# Altium schematic sheet INC_ENC_IF.SchDoc
size 420 x 297 mm; SheetNumber: 5; PageSetup: Record=PageOptions|CenterHorizontal=False|CenterVertical=False|PrintScale=0.95|XCorrection=0.00|YCorrection=0.00|PrintKind=1|BorderSize=5000000|LeftOffset=0|BottomOffset=0|Orientation=1|PaperLength=1000|PaperWidth=1000|Scale=100|PaperSource=15|PrintQuality=600|MediaType=1|DitherType=10|PaperKind=A4|PrintScaleMode=1
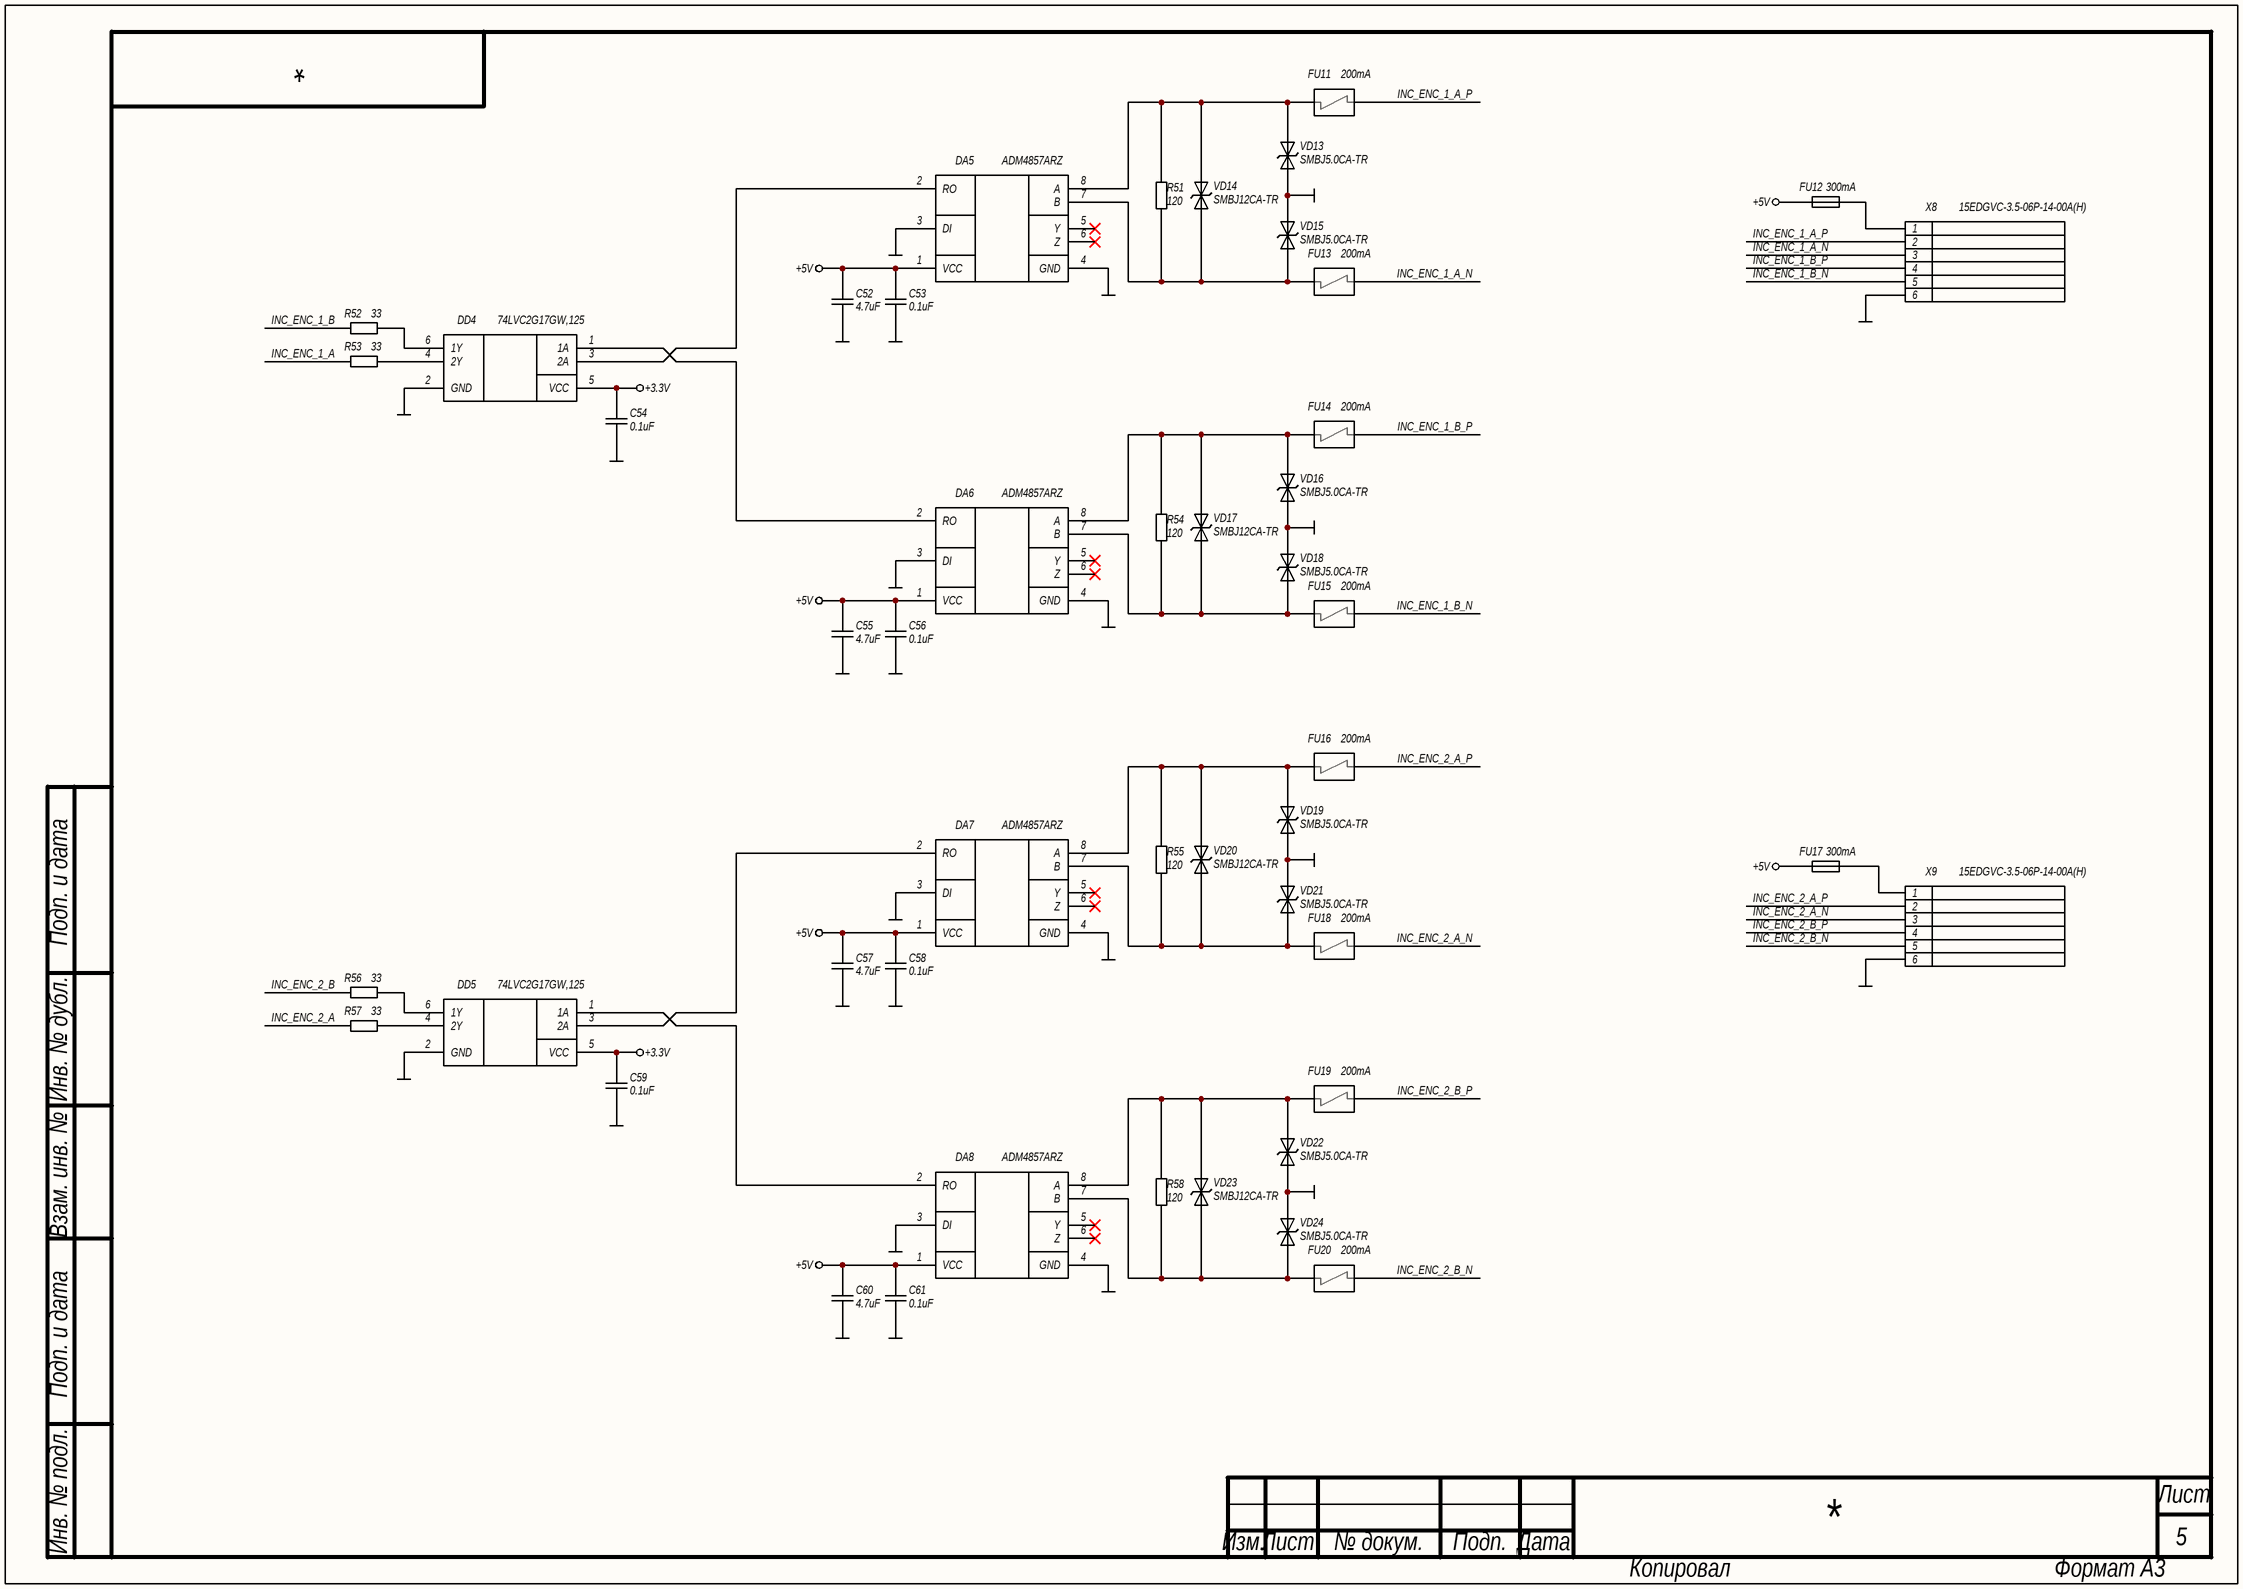
[diagram p0: INC_ENC_IF.SchDoc]

## Parts
C52  4.7uF  [C0603N]
C53  0.1uF  [C0603N]
C54  0.1uF  [C0603N]
C55  4.7uF  [C0603N]
C56  0.1uF  [C0603N]
C57  4.7uF  [C0603N]
C58  0.1uF  [C0603N]
C59  0.1uF  [C0603N]
C60  4.7uF  [C0603N]
C61  0.1uF  [C0603N]
DA5  ADM4857ARZ  [SOIC8]
DA6  ADM4857ARZ  [SOIC8]
DA7  ADM4857ARZ  [SOIC8]
DA8  ADM4857ARZ  [SOIC8]
DD4  74LVC2G17GW,125  [SOT363-2]
DD5  74LVC2G17GW,125  [SOT363-2]
FU11  200mA  [TBU-CA]
FU12  300mA  [MF-MSMF]
FU13  200mA  [TBU-CA]
FU14  200mA  [TBU-CA]
FU15  200mA  [TBU-CA]
FU16  200mA  [TBU-CA]
FU17  300mA  [MF-MSMF]
FU18  200mA  [TBU-CA]
FU19  200mA  [TBU-CA]
FU20  200mA  [TBU-CA]
R51  120  [R0805N]
R52  33  [R0603N]
R53  33  [R0603N]
R54  120  [R0805N]
R55  120  [R0805N]
R56  33  [R0603N]
R57  33  [R0603N]
R58  120  [R0805N]
VD13  SMBJ5.0CA-TR  [SMB]
VD14  SMBJ12CA-TR  [SMB]
VD15  SMBJ5.0CA-TR  [SMB]
VD16  SMBJ5.0CA-TR  [SMB]
VD17  SMBJ12CA-TR  [SMB]
VD18  SMBJ5.0CA-TR  [SMB]
VD19  SMBJ5.0CA-TR  [SMB]
VD20  SMBJ12CA-TR  [SMB]
VD21  SMBJ5.0CA-TR  [SMB]
VD22  SMBJ5.0CA-TR  [SMB]
VD23  SMBJ12CA-TR  [SMB]
VD24  SMBJ5.0CA-TR  [SMB]
X8  15EDGVC-3.5-06P-14-00A(H)  [15EDGVC-3.5-06P-14-00A(H)]
X9  15EDGVC-3.5-06P-14-00A(H)  [15EDGVC-3.5-06P-14-00A(H)]

## Nets
+3.3V: C54.2 C59.2 DD4.5(VCC) DD5.5(VCC)
+5V: C52.2 C53.2 C55.2 C56.2 C57.2 C58.2 C60.2 C61.2 DA5.1(VCC) DA6.1(VCC) DA7.1(VCC) DA8.1(VCC) FU12.1 FU17.1
GND: C52.1 C53.1 C54.1 C55.1 C56.1 C57.1 C58.1 C59.1 C60.1 C61.1 DA5.3(DI) DA5.4(GND) DA6.3(DI) DA6.4(GND) DA7.3(DI) DA7.4(GND) DA8.3(DI) DA8.4(GND) DD4.2(GND) DD5.2(GND) VD13.2(A2) VD15.2(A2) VD16.2(A2) VD18.2(A2) VD19.2(A2) VD21.2(A2) VD22.2(A2) VD24.2(A2) X8.6 X9.6
INC_ENC_1_A: R53.2
INC_ENC_1_A_N: FU13.3(IN/OUT) X8.3
INC_ENC_1_A_P: FU11.3(IN/OUT) X8.2
INC_ENC_1_B: R52.2
INC_ENC_1_B_N: FU15.3(IN/OUT) X8.5
INC_ENC_1_B_P: FU14.3(IN/OUT) X8.4
INC_ENC_2_A: R57.2
INC_ENC_2_A_N: FU18.3(IN/OUT) X9.3
INC_ENC_2_A_P: FU16.3(IN/OUT) X9.2
INC_ENC_2_B: R56.2
INC_ENC_2_B_N: FU20.3(IN/OUT) X9.5
INC_ENC_2_B_P: FU19.3(IN/OUT) X9.4
NetDA5_2: DA5.2(RO) DD4.3(2A)
NetDA5_7: DA5.7(B) FU13.1(IN/OUT) R51.2 VD14.2(A2) VD15.1(A1)
NetDA5_8: DA5.8(A) FU11.1(IN/OUT) R51.1 VD13.1(A1) VD14.1(A1)
NetDA6_2: DA6.2(RO) DD4.1(1A)
NetDA6_7: DA6.7(B) FU15.1(IN/OUT) R54.2 VD17.2(A2) VD18.1(A1)
NetDA6_8: DA6.8(A) FU14.1(IN/OUT) R54.1 VD16.1(A1) VD17.1(A1)
NetDA7_2: DA7.2(RO) DD5.3(2A)
NetDA7_7: DA7.7(B) FU18.1(IN/OUT) R55.2 VD20.2(A2) VD21.1(A1)
NetDA7_8: DA7.8(A) FU16.1(IN/OUT) R55.1 VD19.1(A1) VD20.1(A1)
NetDA8_2: DA8.2(RO) DD5.1(1A)
NetDA8_7: DA8.7(B) FU20.1(IN/OUT) R58.2 VD23.2(A2) VD24.1(A1)
NetDA8_8: DA8.8(A) FU19.1(IN/OUT) R58.1 VD22.1(A1) VD23.1(A1)
NetDD4_4: DD4.4(2Y) R53.1
NetDD4_6: DD4.6(1Y) R52.1
NetDD5_4: DD5.4(2Y) R57.1
NetDD5_6: DD5.6(1Y) R56.1
NetFU12_2: FU12.2 X8.1
NetFU17_2: FU17.2 X9.1

Not connected (* = marked no-connect by the designer): DA5 5(Y)* 6(Z)*; DA6 5(Y)* 6(Z)*; DA7 5(Y)* 6(Z)*; DA8 5(Y)* 6(Z)*

## Notes on the sheet
- Подп. и дата
- Инв. № дубл.
- Взам. инв. №
- Инв. № подл.
- Лист
- Изм.
- № докум.
- Подп.
- Дата
- Копировал
- Формат А3

## Library data of the parts
C52 C55 C57 C60 = CL10A475KO8NNNC: Конденсатор; Точность: 10%; Напряжение: 16V; Диэлектрик: X5R; Производитель: Samsung Electro-Mechanics; Описание: 4.7 µF ±10% 16V Ceramic Capacitor X5R 0603 (1608 Metric); Корпус: 0603 (1608 Metric); Температурный диапазон: -55°C ~ 85°C; Вид монтажа: SMD; Артикул: CL10A475KO8NNNC; Номинал: 4.7uF; Строка для документации: https://mm.digikey.com/Volume0/opasdata/d220001/medias/docus/2328/CL10A475KO8NNNC_Spec.pdf; Тип элемента: Конденсатор
C53 C54 C56 C58 C59 C61 = CL10B104KB8NNNC: Конденсатор; Точность: 10%; Напряжение: 50V; Диэлектрик: X7R; Производитель: Samsung Electro-Mechanics; Описание: 0.1 µF ±10% 50V Ceramic Capacitor X7R 0603 (1608 Metric); Корпус: 0603 (1608 Metric); Температурный диапазон: -55°C ~ 125°C; Вид монтажа: SMD; Артикул: CL10B104KB8NNNC; Номинал: 0.1uF; Строка для документации: https://mm.digikey.com/Volume0/opasdata/d220001/medias/docus/609/CL10B104KB8NNNC_Spec.pdf; Тип элемента: Конденсатор
DA5-DA8 = ADM4857ARZ: Микросхема интерфейса RS485; Производитель: "D:\Altium\Libraries\GOST_LIBS\Libraries\IC\Analog Devices\ADM4852A.SchLib"; Описание: 1/1 Transceiver Full RS422, RS485 8-SOIC; Корпус: 8-SOIC (0.154", 3.90mm Width); Температурный диапазон: -40°C ~ 85°C; Вид монтажа: SMD; Артикул: ADM4857ARZ; Строка для документации: https://www.analog.com/media/en/technical-documentation/data-sheets/ADM4850_4851_4852_4853_4854_4855_4856_4857.pdf; Тип элемента: Микросхема
DD4 DD5 = 74LVC2G17GW,125: Микросхема сдвоенный триггер Шмитта; Производитель: Nexperia USA Inc.; Описание: Buffer, Non-Inverting 2 Element 1 Bit per Element Push-Pull Output 6-TSSOP; Корпус: 6-TSSOP; Температурный диапазон: -40°C ~ 125°C (TA); Вид монтажа: SMD; Артикул: 74LVC2G17GW,125; Строка для документации: https://assets.nexperia.com/documents/data-sheet/74LVC2G17.pdf; Тип элемента: Микросхема
FU11 FU13-FU16 FU18-FU20 = TBU-CA065-200-WH: Полупроводниковый предохранитель; Напряжение: 650V; Тип: Surge Suppression IС; Производитель: Bourns Inc.; Описание: SURGE SUPP TBU 200MA 650VIMP SMD; Корпус: 6.50mm x 4.00mm; Температурный диапазон: -55°C ~ 125°C; Вид монтажа: SMD; Артикул: TBU-CA065-200-WH; Ток: 200mA; Строка для документации: https://www.bourns.com/docs/Product-Datasheets/TBU-CA.pdf; Тип элемента: Предохранитель
FU12 FU17 = MF-MSMF030-2: Плавкий предохранитель; Напряжение: 30V; Тип: PTC Resettable Fuse; Производитель: Bourns Inc.; Описание: Polymeric PTC Resettable Fuse 30V 300 mA Ih Surface Mount 1812 (4532 Metric), Concave; Корпус: 1812 (4532 Metric), Concave; Температурный диапазон: -40°C ~ 85°C; Вид монтажа: SMD; Артикул: MF-MSMF030-2; Ток: 300mA; Строка для документации: https://www.bourns.com/docs/product-datasheets/mf-msmf.pdf; Тип элемента: Предохранитель
R51 R54 R55 R58 = RC0805FR-07120RL: Резистор; Точность: 1%; ТКС: ±100ppm/°C; Напряжение: 150V; Производитель: YAGEO; Описание: 120 Ohms ±1% 0.125W, 1/8W Chip Resistor 0805 (2012 Metric) Moisture Resistant Thick Film; Корпус: 0805 (2012 Metric); Температурный диапазон: -55°C ~ 155°C; Вид монтажа: SMD; Артикул: RC0805FR-07120RL; Номинал: 120; Строка для документации: https://www.yageo.com/upload/media/product/productsearch/datasheet/rchip/PYu-RC_Group_51_RoHS_L_12.pdf; Тип элемента: Резистор
R52 R53 R56 R57 = RC0603FR-0733RL: Резистор; Точность: 1%; ТКС: ±100ppm/°C; Напряжение: 75V; Производитель: YAGEO; Описание: 33 Ohms ±1% 0.1W, 1/10W Chip Resistor 0603 (1608 Metric) Moisture Resistant Thick Film; Корпус: 0603 (1608 Metric); Температурный диапазон: -55°C ~ 155°C; Вид монтажа: SMD; Артикул: RC0603FR-0733RL; Номинал: 33; Строка для документации: https://www.yageo.com/upload/media/product/app/datasheet/rchip/pyu-rc_group_51_rohs_l.pdf; Тип элемента: Резистор
VD13 VD15 VD16 VD18 VD19 VD21 VD22 VD24 = SMBJ5.0CA-TR: TVS диод двунаправленный; Напряжение: 5V; Напряжение ограничения: 9.2V; Напряжение пробоя: 6.4V; Ток: 68A; Тип: TVS Bidirectional; Производитель: STMicroelectronics; Описание: 9.2V Clamp 68A Ipp Tvs Diode Surface Mount SMB (DO-214AA); Корпус: DO-214AA, SMB; Температурный диапазон: -55°C ~ 150°C (TJ); Вид монтажа: SMD; Тип элемента: Диод защитный; Артикул: SMBJ5.0CA-TR; Строка для документации: https://www.st.com/content/ccc/resource/technical/document/datasheet/19/78/91/39/07/cd/40/65/CD00001366.pdf/files/CD00001366.pdf/_jcr_content/translations/en.CD00001366.pdf
VD14 VD17 VD20 VD23 = SMBJ12CA-TR: TVS диод двунаправленный; Напряжение: 12V; Напряжение ограничения: 19.9V; Напряжение пробоя: 13.3V; Ток: 31A; Тип: TVS Bidirectional; Производитель: STMicroelectronics; Описание: 19.9V Clamp 31A Ipp Tvs Diode Surface Mount SMB (DO-214AA); Корпус: DO-214AA, SMB; Температурный диапазон: -55°C ~ 150°C (TJ); Вид монтажа: SMD; Тип элемента: Диод защитный; Артикул: SMBJ12CA-TR; Строка для документации: https://www.st.com/content/ccc/resource/technical/document/datasheet/19/78/91/39/07/cd/40/65/CD00001366.pdf/files/CD00001366.pdf/_jcr_content/translations/en.CD00001366.pdf
X8 X9 = 15EDGVC-3.5-06P-14-00A(H): Разъем, 6 контактов; Тип разъема: Pluggable terminal block; Количество контактов: 6; Шаг контактов: 3.5mm; Ток: 7A; Напряжение: 250V; Производитель: Degson Electronics; Описание: Pluggable terminal block; 3.5mm; ways: 6; straight; socket; male; Температурный диапазон: -40°C ~ 105°C; Вид монтажа: Through Hole; Артикул: 15EDGVC-3.5-06P-14-00A(H); Строка для документации: https://www.tme.eu/Document/83e7173fe653a2d0e44585e87978945b/opr014R8.pdf; Тип элемента: Разъем